# Altium project PCB_Project2.PrjPCB
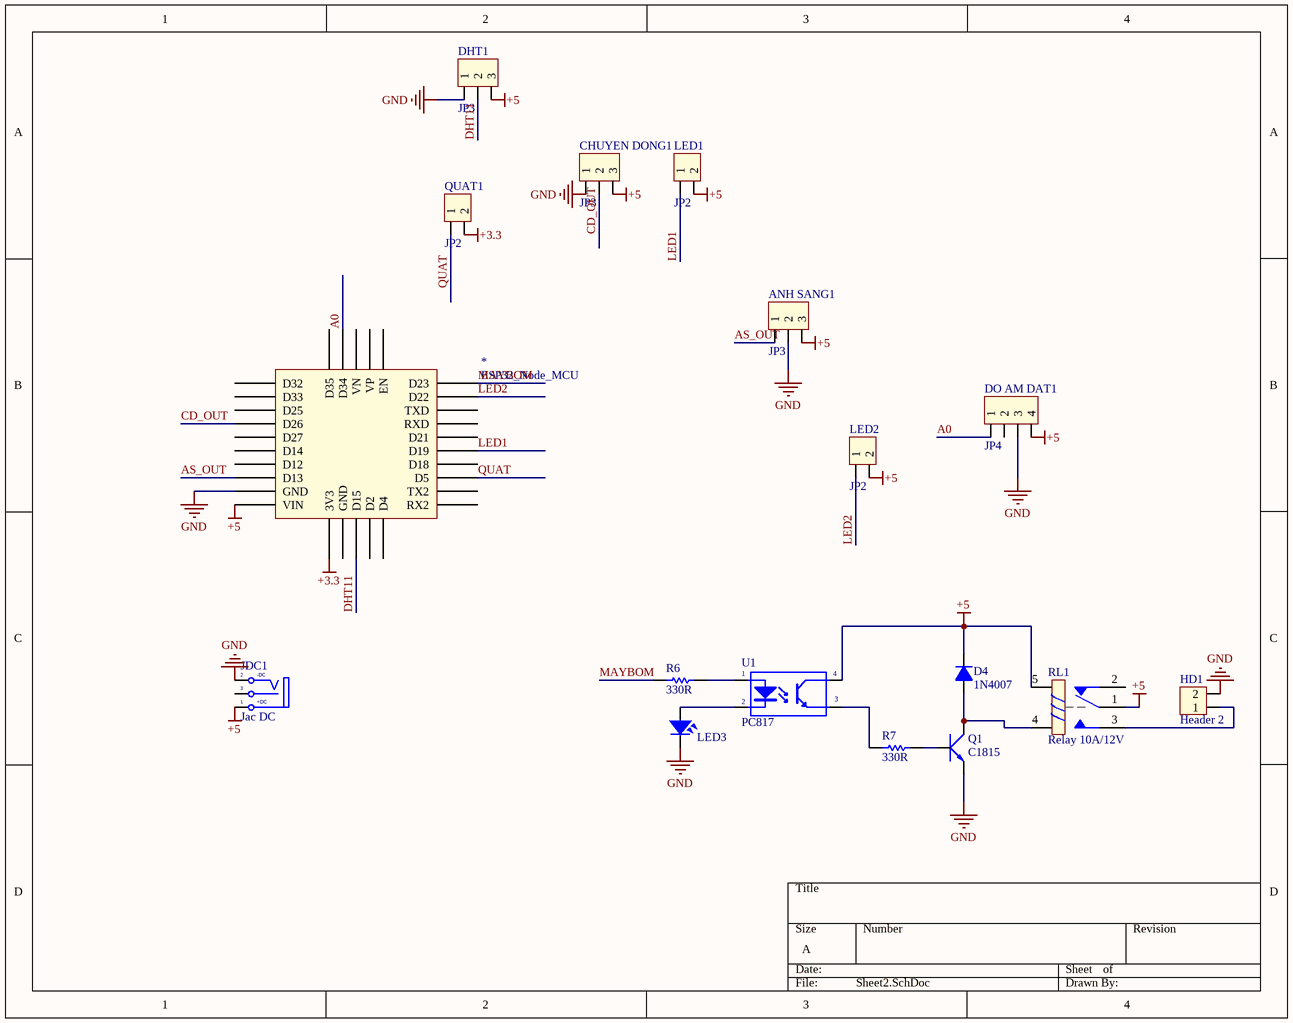
[diagram p0: Sheet2.SchDoc]
1 sheet, 17 parts. Net scope: global (net labels, ports and power ports of the same name join across sheets).
Board files: PCB3.PcbDoc, v3_2.pcbdoc, AirSENSE_V3.PcbDoc

## Sheet Sheet2.SchDoc
size A

### Parts
*  ESP32_Node_MCU  [ESP32 NODE MCU]
ANH_SANG1  JP3  [CON3]
CHUYEN_DONG1  JP3  [CON3]
D4  1N4007  [D1A]
DHT1  JP3  [CON3]
DO_AM_DAT1  JP4  [CON4]
HD1  Header 2  [HED2]
JDC1  Jac DC  [DC-IN]
LED1  JP2  [CON2]
LED2  JP2  [CON2]
LED3  LED  [LED-3]  (value not drawn)
Q1  C1815  [QTO-92]
QUAT1  JP2  [CON2]
R6  value 330R  [R1/4W]  (hidden comment: Res1)
R7  value 330R  [R1/4W]  (hidden comment: Res1)
RL1  Relay 10A/12V  [RL_SPDT_10A]
U1  PC817  [DIP4]

### Nets
+3.3: *.16(3V3) QUAT1.2
+5: *.15(VIN) ANH_SANG1.3 CHUYEN_DONG1.3 D4.2(K) DHT1.3 DO_AM_DAT1.4 JDC1.1(T) LED1.2 LED2.2 RL1.1 RL1.5 U1.4(C)
GND: *.14(GND) ANH_SANG1.2 CHUYEN_DONG1.1 DHT1.1 DO_AM_DAT1.3 HD1.2 JDC1.2(TN) LED3.2 Q1.1(E)
A0: *.4(D34) DO_AM_DAT1.1
AS_OUT: *.13(D13) ANH_SANG1.1
CD_OUT: *.9(D26) CHUYEN_DONG1.2
DHT11: *.18(D15) DHT1.2
LED1: *.25(D19) LED1.1
LED2: *.29(D22) LED2.1
MAYBOM: *.30(D23) R6.2
QUAT: *.23(D5) QUAT1.1
NetD4_1: D4.1(A) Q1.2(C) RL1.4
NetHD1_1: HD1.1 RL1.3
NetLED3_1: LED3.1 U1.2(K)
NetQ1_3: Q1.3(B) R7.1
NetR6_1: R6.1 U1.1(A)
NetR7_2: R7.2 U1.3(E)

Not connected (* = marked no-connect by the designer): * 1(EN) 2(VP) 3(VN) 5(D35) 6(D32) 7(D33) 8(D25) 10(D27) 11(D14) 12(D12) 17(GND) 19(D2) 20(D4) 21(RX2) 22(TX2) 24(D18) 26(D21) 27(RXD) 28(TXD); DO_AM_DAT1 2; JDC1 3(S); RL1 2

### Notes on the sheet
- (in symbol DCIN) -DC; +DC

### Library data of the parts
ANH_SANG1 CHUYEN_DONG1 DHT1 = Con3: Connector 3; Value: Connector 3
D4 = D1A: Diode 1A; Value: 1N4007
DO_AM_DAT1 = Con4: Connector 4; Value: Connector 4
HD1 = Hed2: Header 2 (Green); Value: Header 2
JDC1 = DCIN: Jac DC input; Value: Jac DC
LED1 LED2 QUAT1 = Con2: Connector 2; Value: Connector 2
LED3 = LED: LED Single colour Green and Red; Value: LED 3 ly Single Colour
Q1 = C1815: NPN 600mW, ECB; Value: C1815
R6 R7 = Res1_1: Resistor; Manufacturer: Generic Components; Class: Passive; Published: 08/06/2000; Publisher: Altium Hobart Technology Centre; SubClass: Resistor
RL1 = Relay 1: Relay SPDT,10A - 12VDC 5 Pin; Value: Relay SPDT, 10A, 12V
U1 = PC817: Single Opto; Value: PC817